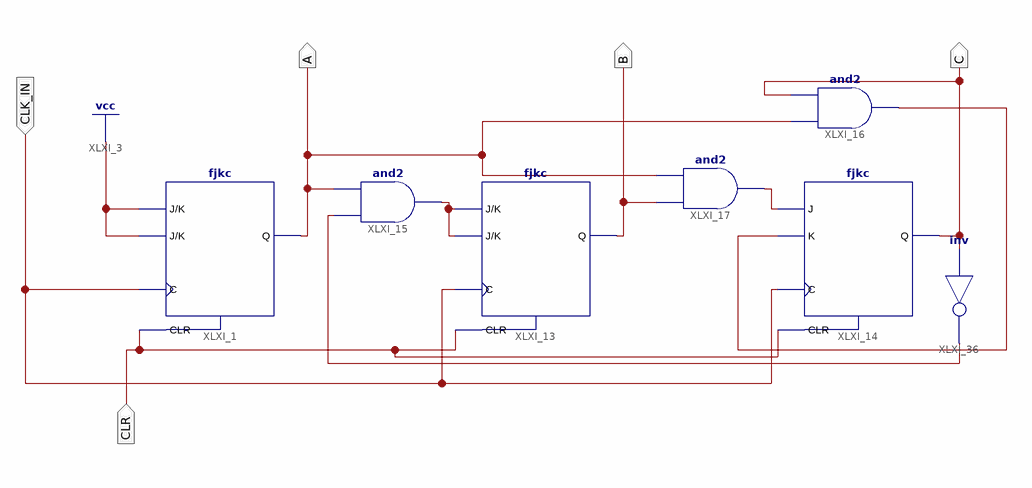
[diagram p0: schematic sheet 1]
// Xilinx ISE schematic jkCounter0to5.sch (spartan6) as structural Verilog: 7 symbols, 5 ports
module jkCounter0to5 (
  input  CLR,
  input  CLK_IN,
  output A,
  output C,
  output B
);

  wire XLXN_68, XLXN_69, XLXN_74, XLXN_75;

  and XLXI_16 (XLXN_75, A, C);
  not XLXI_36 (XLXN_74, C);
  and XLXI_15 (XLXN_68, XLXN_74, A);
  and XLXI_17 (XLXN_69, B, A);
  fjkc XLXI_14 (.C(CLK_IN), .CLR(CLR), .J(XLXN_69), .K(XLXN_75), .Q(C));
  fjkc XLXI_13 (.C(CLK_IN), .CLR(CLR), .J(XLXN_68), .K(XLXN_68), .Q(B));
  fjkc XLXI_1 (.C(CLK_IN), .CLR(CLR), .J(1'b1), .K(1'b1), .Q(A));
endmodule
